# EasyEDA schematic ToyCar.json
TITLE: Sheet_1; REV: 1.0; Date: 2026-07-24; Sheet: 1/1; Company: Your Company
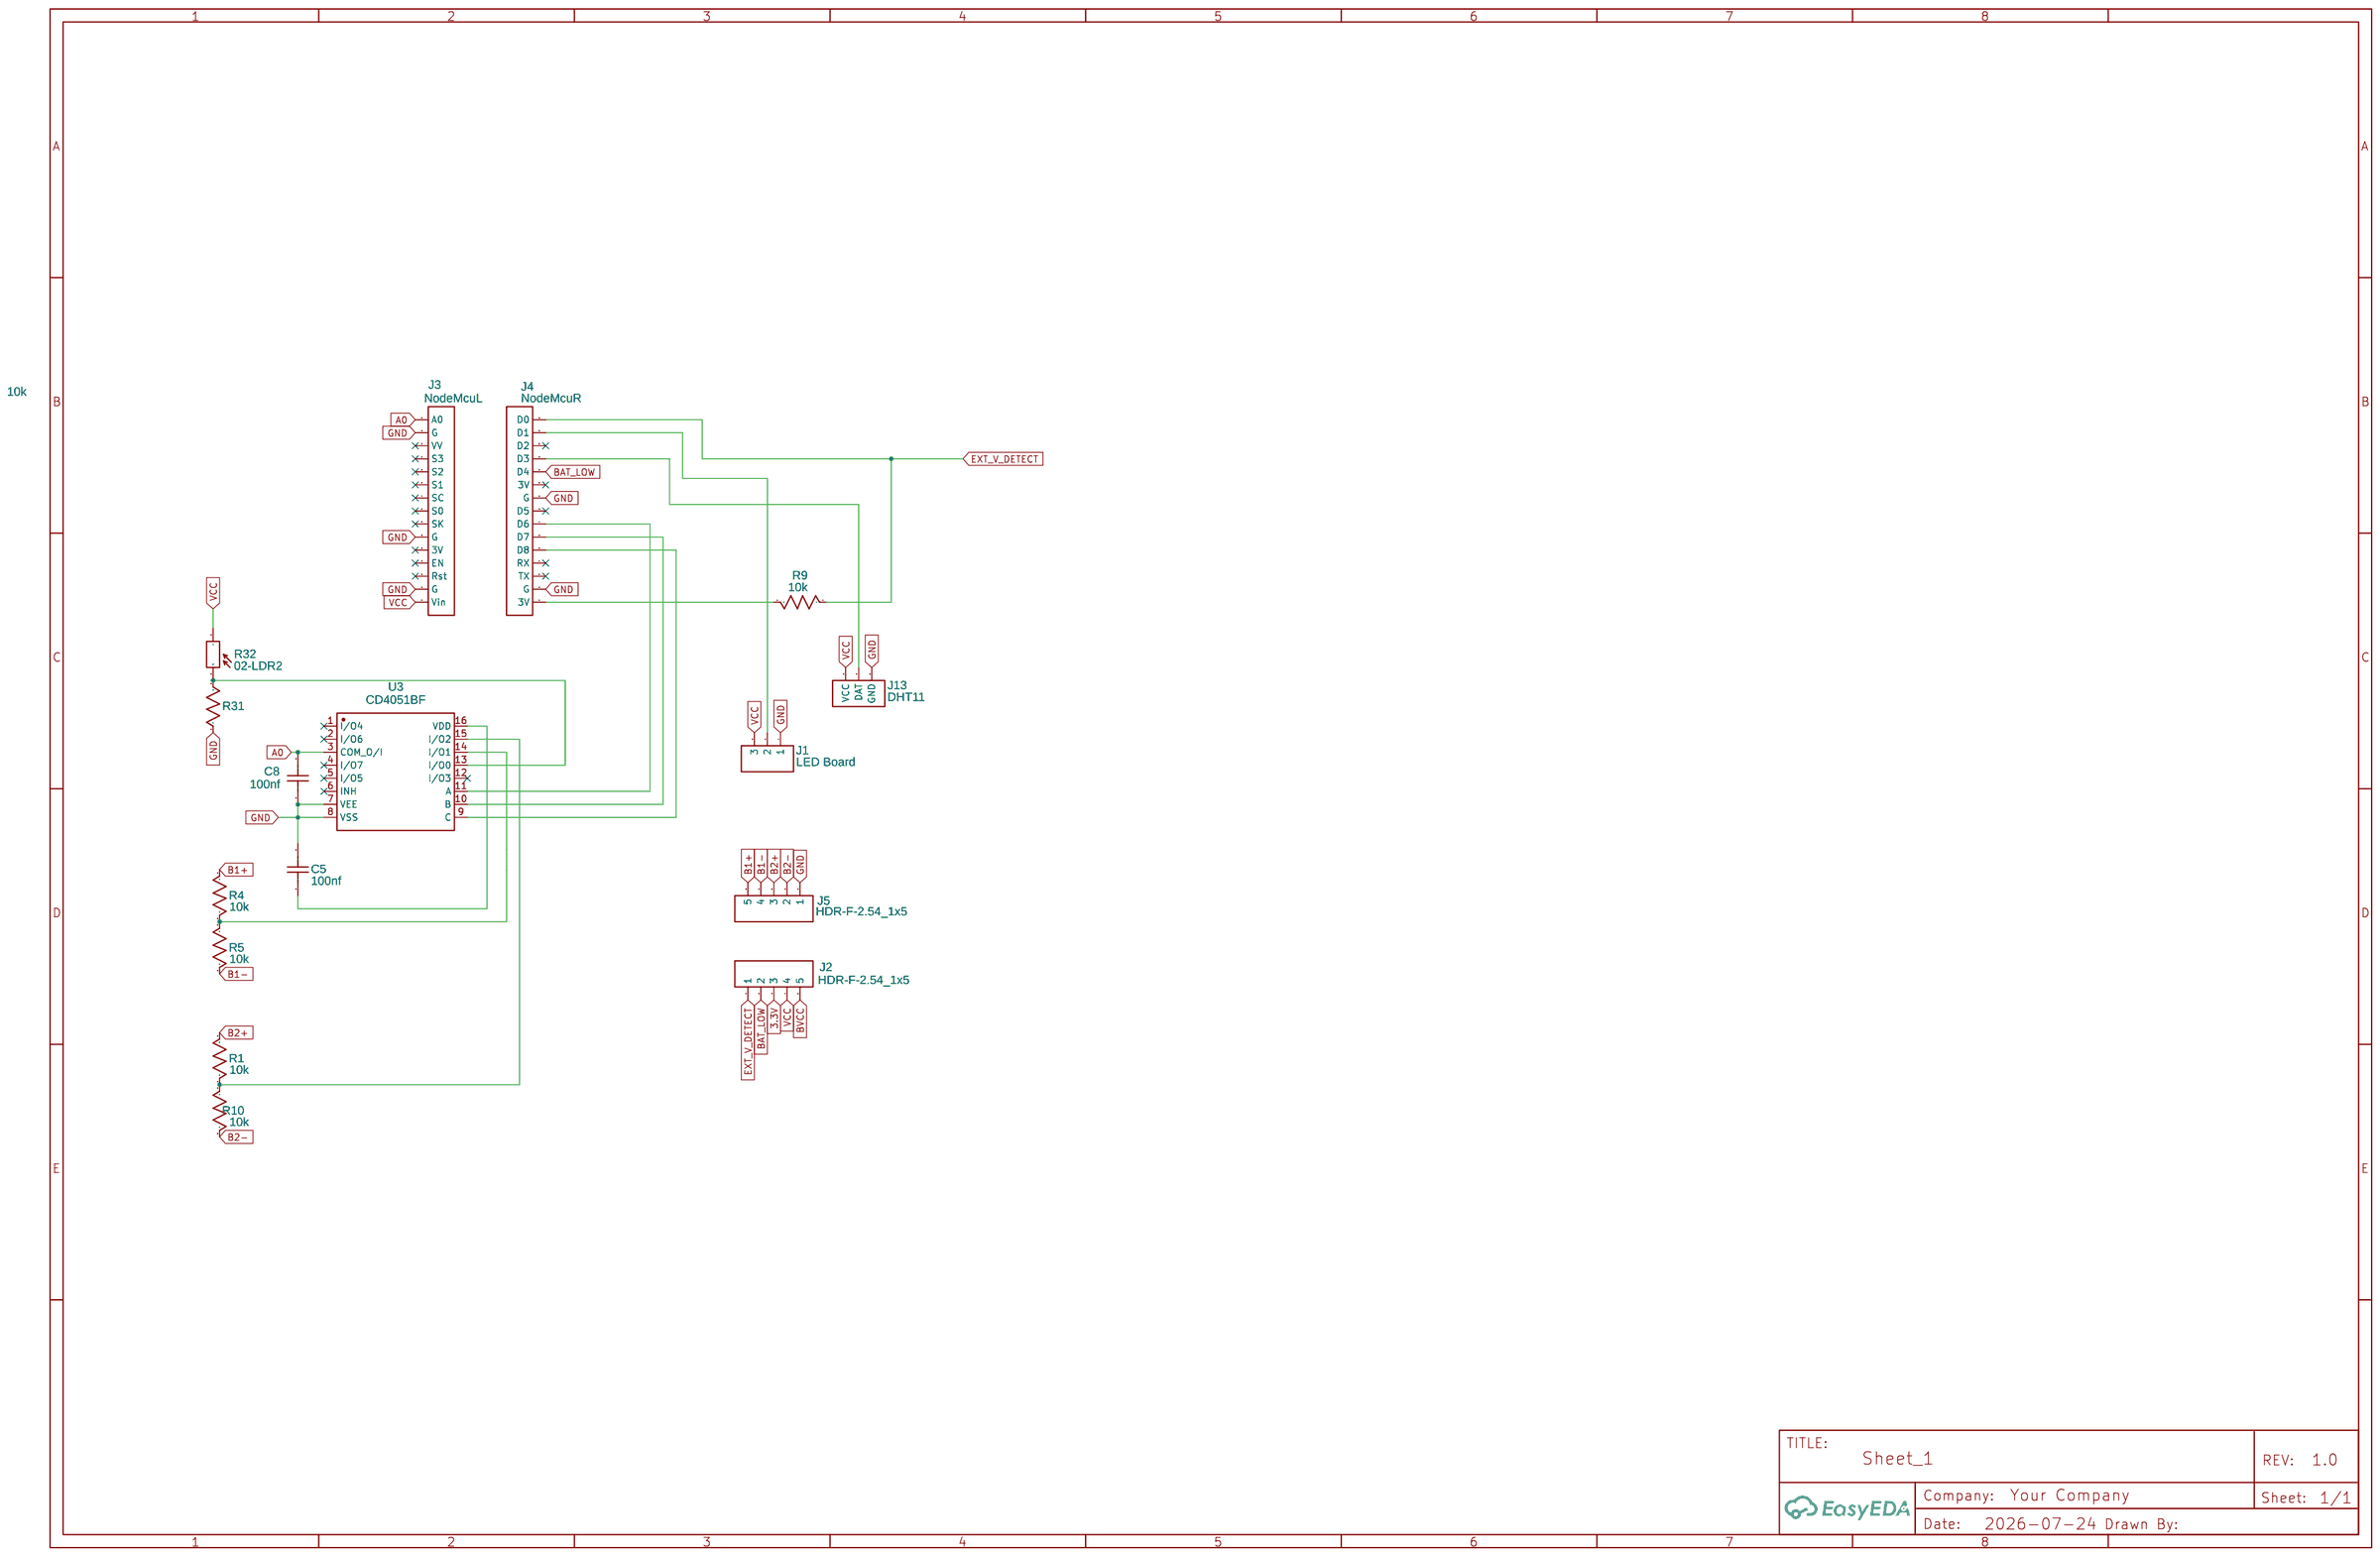
[diagram p0: schematic sheet]

## Parts
C5  100nf  [RAD-0.1]
C8  100nf  [RAD-0.1]
J1  LED Board  [HDR-M-2.54_1X3]
J2  HDR-F-2.54_1x5  [HDR-M-2.54_1X5]
J3  NodeMcuL  [HDR-M-2.54_1X15]
J4  NodeMcuR  [HDR-M-2.54_1X15]
J5  HDR-F-2.54_1x5  [HDR-M-2.54_1X5]
J13  DHT11  [HDR-M-2.54_1X3]
R1  10k  [R_AXIAL-0.3]
R4  10k  [R_AXIAL-0.3]
R5  10k  [R_AXIAL-0.3]
R9  10k  [R_AXIAL-0.3]
R10  10k  [R_AXIAL-0.3]
R31  10k  [R_AXIAL-0.3]
R32  02-LDR2  [RES-TH_L5.0-W4.3-P3.40-D0.5]
U3  CD4051BF  [PDIP-16_L19.3-W6.4-P2.54-LS7.94-BL]

## Library data of the parts
C5 C8 = C_RAD-0.1_US: Contributor: LCEDA_Lib
J1 J13 = HDR-M-2.54_1x3: Supplier Part: C180248; Supplier: LCSC; Contributor: LCEDA_Lib
J2 J5 = HDR-M-2.54_1x5: Supplier Part: C358687; Supplier: LCSC; Contributor: LCEDA_Lib
J3 J4 = HDR-M-2.54_1x15: Supplier Part: C124373; Supplier: LCSC; Contributor: LCEDA_Lib
R1 R4 R5 R9 R10 R31 = R_AXIAL-0.3_US: Contributor: LCEDA_Lib
R32 = 02-LDR2: Supplier: LCSC; Supplier Part: C17271554; Manufacturer: NTE Electronics; JLCPCB Part Class: Extended Part; Contributor: lcsc
U3 = CD4051BF: Contributor: lcsc; Supplier: LCSC; Supplier Part: C3657417; Manufacturer: TI(德州仪器); JLCPCB Part Class: Extended Part

## Nets
3.3V: J2.3
GND: C5.1 C8.2 J1.1 J3.2(G) J3.10(G) J3.14(G) J4.2(G) J4.9(G) J5.1 J13.1(GND) R31.1 U3.7(VEE) U3.8(VSS)
VCC: J1.3 J2.4 J3.15(Vin) J13.3(VCC) R32.1
A0: C8.1 J3.1(A0) U3.3(COM_O/I)
B1+: J5.5 R4.1
B1-: J5.4 R5.2
B2+: J5.3 R1.1
B2-: J5.2 R10.2
BAT_LOW: J2.2 J4.11(D4)
BVCC: J2.5
EXT_V_DETECT: J2.1 J4.15(D0) R9.1
Net-(C5-2): C5.2 U3.16(VDD)
Net-(J1-2): J1.2 J4.14(D1)
Net-(J4-1): J4.1(3V) R9.2
Net-(J4-5): J4.5(D8) U3.9(C)
Net-(J4-6): J4.6(D7) U3.10(B)
Net-(J4-7): J4.7(D6) U3.11(A)
Net-(J4-12): J4.12(D3) J13.2(DAT)
Net-(R1-2): R1.2 R10.1 U3.15(I/O2)
Net-(R4-2): R4.2 R5.1 U3.14(I/O1)
Net-(R31-2): R31.2 R32.2 U3.13(I/O0)

Not connected (* = marked no-connect by the designer): J3 3(VV)* 4(S3)* 5(S2)* 6(S1)* 7(SC)* 8(S0)* 9(SK)* 11(3V)* 12(EN)* 13(Rst)*; J4 3(TX)* 4(RX)* 8(D5)* 10(3V)* 13(D2)*; U3 1(I/O4)* 2(I/O6)* 4(I/O7)* 5(I/O5)* 6(INH)* 12(I/O3)*
